# EAGLE design AlienWhoopF7-ESP32 (EAGLE 9.0.0)
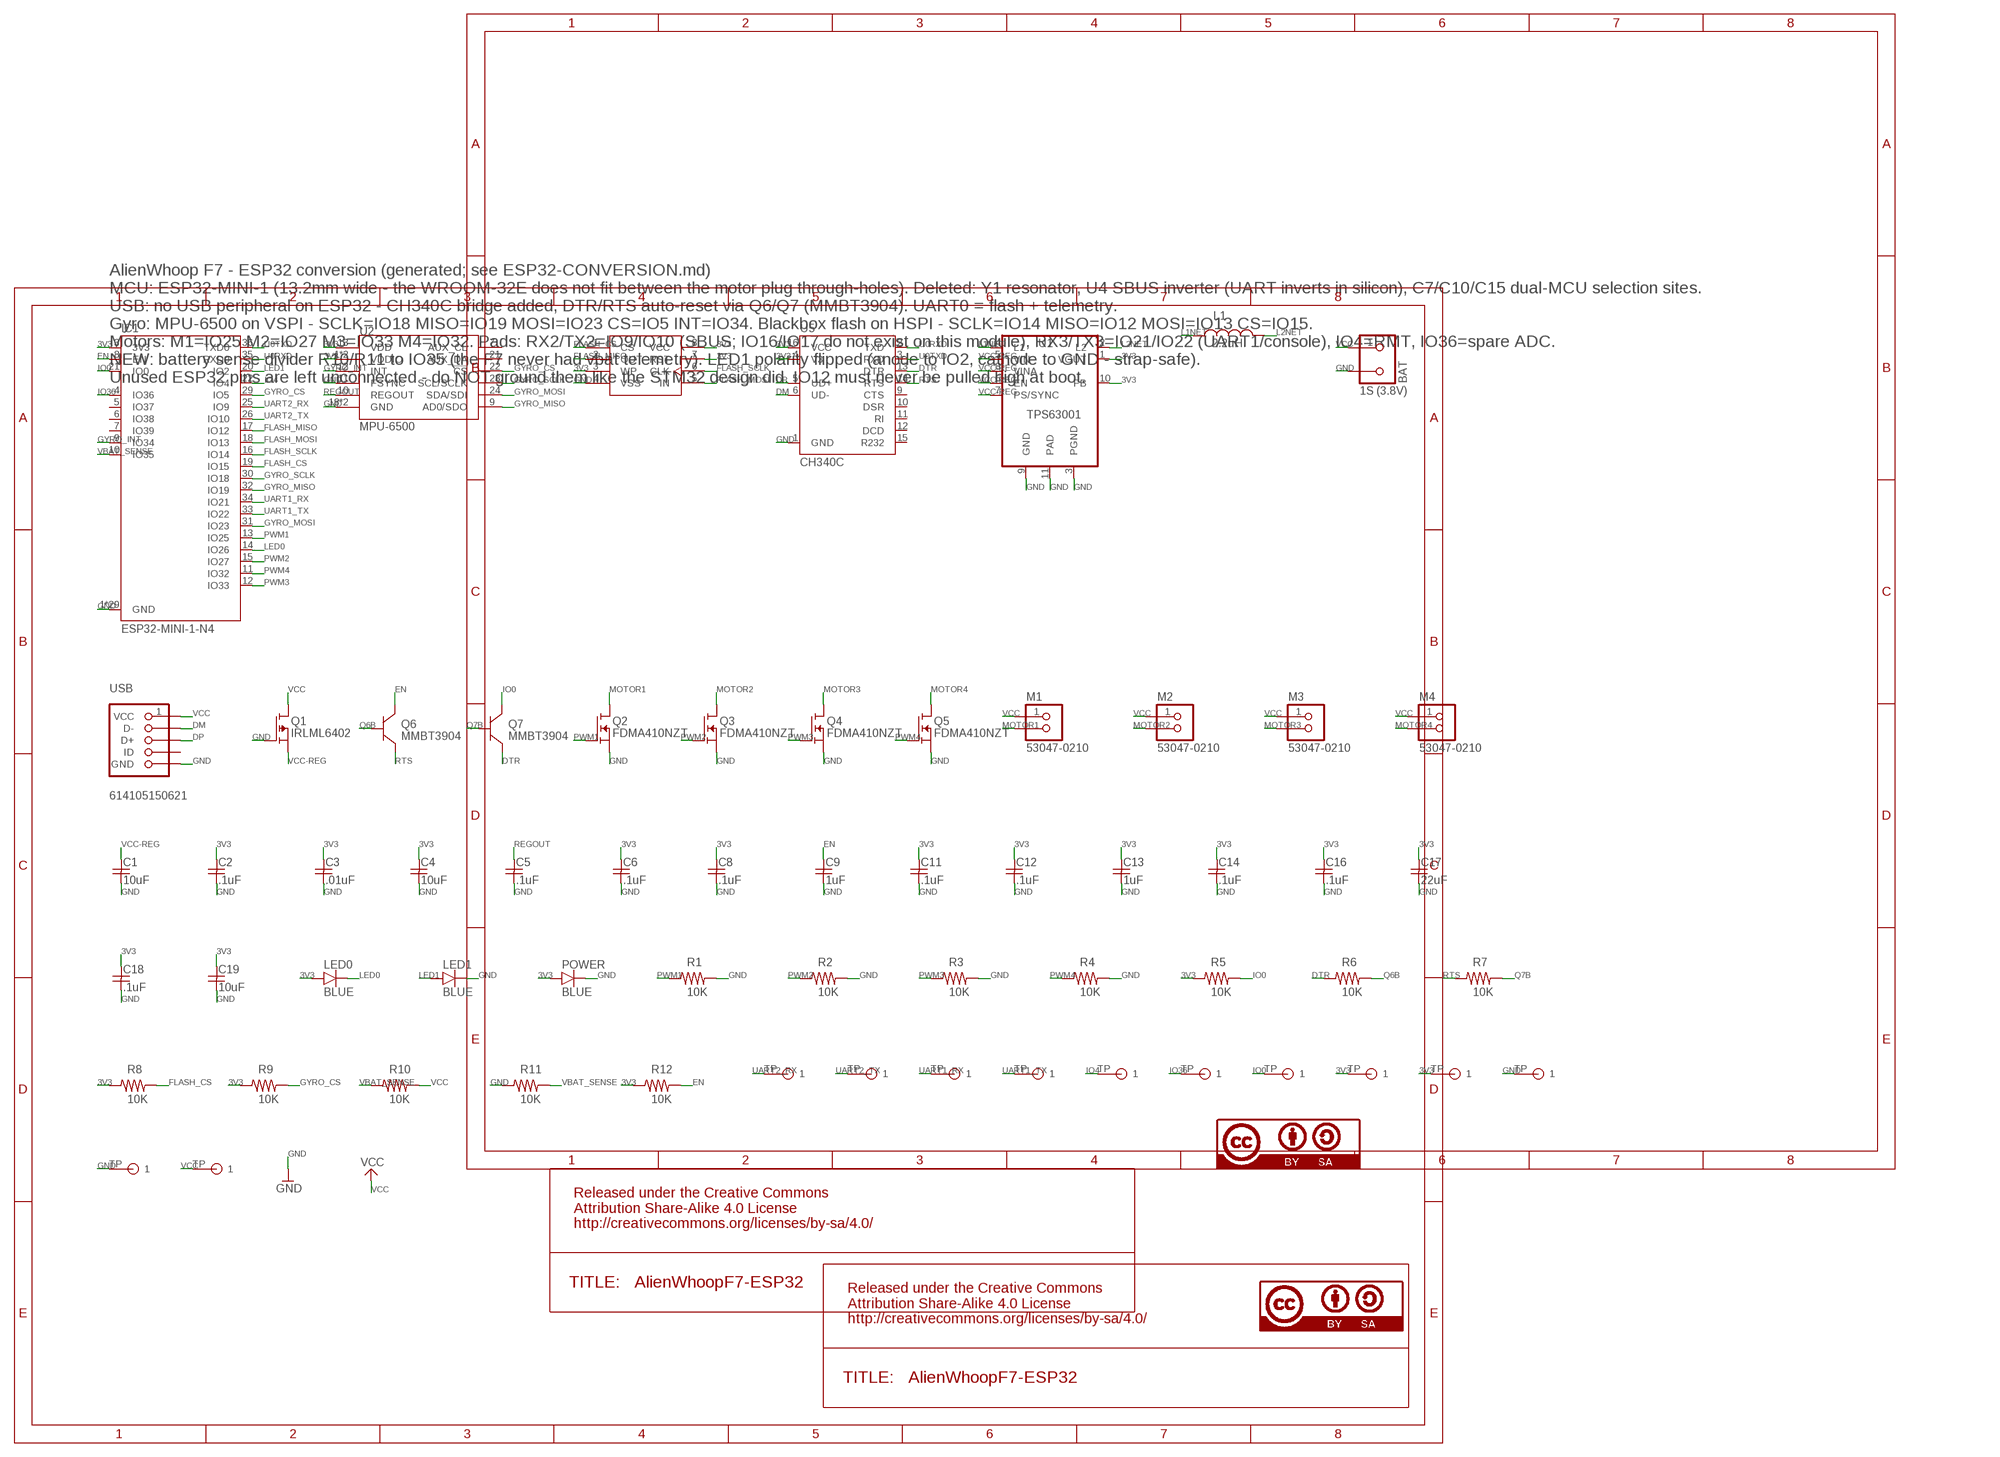
[diagram p0: schematic, sheet 1]

## Parts
3.3V  TESTPAD  [TESTPAD]
3V3  TESTPAD  [TESTPAD]
BAT  1S (3.8V)  JST-PH-BAT  [S2B-PH-K-S]
BOOT  TESTPAD  [TESTPAD]
C1  10uF  CAPACITOR10UF  [YUDEN-CAP-0805]
C2  .1uF  CAPACITOR.1UF  [MUR-CAP-0603]
C3  .01uF  CAPACITOR.01UF  [MUR-CAP-0603]
C4  10uF  CAPACITOR10UF  [YUDEN-CAP-0805]
C5  .1uF  CAPACITOR.1UF  [MUR-CAP-0603]
C6  .1uF  CAPACITOR.1UF  [MUR-CAP-0603]
C8  .1uF  CAPACITOR.1UF  [MUR-CAP-0603]
C9  1uF  CAPACITOR1UF  [MUR-CAP-0603]
C11  .1uF  CAPACITOR.1UF  [MUR-CAP-0603]
C12  .1uF  CAPACITOR.1UF  [MUR-CAP-0603]
C13  1uF  CAPACITOR1UF  [MUR-CAP-0603]
C14  .1uF  CAPACITOR.1UF  [MUR-CAP-0603]
C16  .1uF  CAPACITOR.1UF  [MUR-CAP-0603]
C17  22uF  CAPACITOR22UF  [YUDEN-CAP-0805]
C18  .1uF  CAPACITOR.1UF  [MUR-CAP-0603]
C19  10uF  CAPACITOR10UF  [YUDEN-CAP-0805]
GND  TESTPAD  [TESTPAD]
GND@1  TESTPAD  [TESTPAD]
IC1  ESP32-MINI-1-N4  ESP32-MINI-1  [ESP32-MINI-1]
IO4  TESTPAD  [TESTPAD]
IO36  TESTPAD  [TESTPAD]
L1  2.2uH  DFE201612E-2R2M-P2  [DFE201612E-2R2M-P2]
LED0  BLUE  SMD-CHIP-LED-0805  [SMD-CHIP-LED-0805]
LED1  BLUE  SMD-CHIP-LED-0805  [SMD-CHIP-LED-0805]
M1  53047-0210  PICO-1.25-MOTOR  [PICO-53047-02]
M2  53047-0210  PICO-1.25-MOTOR  [PICO-53047-02]
M3  53047-0210  PICO-1.25-MOTOR  [PICO-53047-02]
M4  53047-0210  PICO-1.25-MOTOR  [PICO-53047-02]
POWER  BLUE  SMD-CHIP-LED-0805  [SMD-CHIP-LED-0805]
Q1  IRLML6402  MOSFET-P  [SOT-23]
Q2  FDMA410NZT  FDMA410NZ  [MICROFET-2X2]
Q3  FDMA410NZT  FDMA410NZ  [MICROFET-2X2]
Q4  FDMA410NZT  FDMA410NZ  [MICROFET-2X2]
Q5  FDMA410NZT  FDMA410NZ  [MICROFET-2X2]
Q6  MMBT3904  [SOT23]
Q7  MMBT3904  [SOT23]
R1  10K  RESISTOR10K  [VISH-RES-0603]
R2  10K  RESISTOR10K  [VISH-RES-0603]
R3  10K  RESISTOR10K  [VISH-RES-0603]
R4  10K  RESISTOR10K  [VISH-RES-0603]
R5  10K  RESISTOR10K  [VISH-RES-0603]
R6  10K  RESISTOR10K  [VISH-RES-0603]
R7  10K  RESISTOR10K  [VISH-RES-0603]
R8  10K  RESISTOR10K  [VISH-RES-0603]
R9  10K  RESISTOR10K  [VISH-RES-0603]
R10  10K  RESISTOR10K  [VISH-RES-0603]
R11  10K  RESISTOR10K  [VISH-RES-0603]
R12  10K  RESISTOR10K  [VISH-RES-0603]
RX2  TESTPAD  [TESTPAD]
RX3  TESTPAD  [TESTPAD]
TX2  TESTPAD  [TESTPAD]
TX3  TESTPAD  [TESTPAD]
U1  TPS63001  TPS630XX-TPS63001  [VSON-N10]
U2  MPU-6500  MPU-9250  [QFN24_PAD]
U3  MX25L6406EM2I-12G  M25P32  [M25P32]
U5  CH340C  [SOP16]
USB  614105150621  MICROUSBUSB-BFPV  [USB-BFPV]
VCC@1  TESTPAD  [TESTPAD]

## Nets
3V3: 3.3V.TP 3V3.TP C2.1 C3.1 C4.1 C6.1 C8.1 C11.1 C12.1 C13.1 C14.1 C16.1 C17.1 C18.1 C19.1 IC1.3(3V3) LED0.A POWER.A R5.2 R8.2 R9.2 R12.2 U1.1(VOUT) U1.10(FB) U2.1(VDDIO) U2.8(VDDIO) U2.13(VDD) U3.3(WP) U3.7(RST) U3.8(VCC) U5.4(V3) U5.16(VCC)
DM: U5.6(UD-) USB.2(D-)
DP: U5.5(UD+) USB.3(D+)
DTR: Q7.2(E) R6.2 U5.13(DTR)
EN: C9.1 IC1.8(EN) Q6.3(C) R12.1
FLASH_CS: IC1.19(IO15) R8.1 U3.1(CS)
FLASH_MISO: IC1.17(IO12) U3.2(OUT)
FLASH_MOSI: IC1.18(IO13) U3.5(IN)
FLASH_SCLK: IC1.16(IO14) U3.6(CLK)
GND: BAT.2 C1.2 C2.2 C3.2 C4.2 C5.2 C6.2 C8.2 C9.2 C11.2 C12.2 C13.2 C14.2 C16.2 C17.2 C18.2 C19.2 GND.TP GND@1.TP IC1.1(GND) IC1.2(GND) IC1.27(GND) IC1.38(GND) IC1.39(GND) IC1.40(GND) IC1.41(GND) IC1.42(GND) IC1.43(GND) IC1.44(GND) IC1.45(GND) IC1.46(GND) IC1.47(GND) IC1.48(GND) IC1.49(GND) IC1.50(GND) IC1.51(GND) IC1.52(GND) IC1.53(GND) IC1.54(GND) IC1.55(GND) IC1.T1(GND) IC1.T2(GND) IC1.T3(GND) IC1.T4(GND) IC1.T5(GND) IC1.T6(GND) IC1.T7(GND) IC1.T8(GND) LED1.C POWER.C Q1.1(G) Q2.S Q2.S1(S) Q3.S Q3.S1(S) Q4.S Q4.S1(S) Q5.S Q5.S1(S) R1.1 R2.1 R3.1 R4.1 R11.2 U1.3(PGND) U1.9(GND) U1.11(PAD) U2.11(FSYNC) U2.18(GND) U2.20(GND) U3.4(VSS) U5.1(GND) USB.5(GND) USB.P$6(GND) USB.P$7(GND)
GYRO_CS: IC1.29(IO5) R9.1 U2.22(!CS)
GYRO_INT: IC1.9(IO34) U2.12(INT)
GYRO_MISO: IC1.32(IO19) U2.9(AD0/SDO)
GYRO_MOSI: IC1.31(IO23) U2.24(SDA/SDI)
GYRO_SCLK: IC1.30(IO18) U2.23(SCL/SCLK)
IO0: BOOT.TP IC1.21(IO0) Q7.3(C) R5.1
IO4: IC1.22(IO4) IO4.TP
IO36: IC1.4(IO36) IO36.TP
L1NET: L1.P$1 U1.4(L1)
L2NET: L1.P$2 U1.2(L2)
LED0: IC1.14(IO26) LED0.C
LED1: IC1.20(IO2) LED1.A
MOTOR1: M1.2 Q2.D Q2.D1(D) Q2.D2(D) Q2.D3(D) Q2.D4(D)
MOTOR2: M2.2 Q3.D Q3.D1(D) Q3.D2(D) Q3.D3(D) Q3.D4(D)
MOTOR3: M3.2 Q4.D Q4.D1(D) Q4.D2(D) Q4.D3(D) Q4.D4(D)
MOTOR4: M4.2 Q5.D Q5.D1(D) Q5.D2(D) Q5.D3(D) Q5.D4(D)
PWM1: IC1.13(IO25) Q2.G R1.2
PWM2: IC1.15(IO27) Q3.G R2.2
PWM3: IC1.12(IO33) Q4.G R3.2
PWM4: IC1.11(IO32) Q5.G R4.2
Q6B: Q6.1(B) R6.1
Q7B: Q7.1(B) R7.1
REGOUT: C5.1 U2.10(REGOUT)
RTS: Q6.2(E) R7.2 U5.14(RTS)
U0RXD: IC1.35(RXD0) U5.2(TXD)
U0TXD: IC1.36(TXD0) U5.3(RXD)
UART1_RX: IC1.34(IO21) RX3.TP
UART1_TX: IC1.33(IO22) TX3.TP
UART2_RX: IC1.25(IO9) RX2.TP
UART2_TX: IC1.26(IO10) TX2.TP
VBAT_SENSE: IC1.10(IO35) R10.2 R11.1
VCC: BAT.1 M1.1 M2.1 M3.1 M4.1 Q1.3(D) R10.1 USB.1(VCC) VCC@1.TP
VCC-REG: C1.1 Q1.2(S) U1.5(VIN) U1.6(EN) U1.7(PS/SYNC) U1.8(VINA)
Unconnected: IC1.5(IO37) IC1.6(IO38) IC1.7(IO39) U2.7(AUX_CL) U2.21(AUX_DA) U5.9(CTS) U5.10(DSR) U5.11(RI) U5.12(DCD) U5.15(R232) USB.4(ID)

## Notes on the sheet
- AlienWhoop F7 - ESP32 conversion (generated; see ESP32-CONVERSION.md)
- MCU: ESP32-MINI-1 (13.2mm wide - the WROOM-32E does not fit between the motor plug through-holes). Deleted: Y1 resonator, U4 SBUS inverter (UART inverts in silicon), C7/C10/C15 dual-MCU selection sites.
- USB: no USB peripheral on ESP32 - CH340C bridge added, DTR/RTS auto-reset via Q6/Q7 (MMBT3904). UART0 = flash + telemetry.
- Gyro: MPU-6500 on VSPI - SCLK=IO18 MISO=IO19 MOSI=IO23 CS=IO5 INT=IO34. Blackbox flash on HSPI - SCLK=IO14 MISO=IO12 MOSI=IO13 CS=IO15.
- Motors: M1=IO25 M2=IO27 M3=IO33 M4=IO32. Pads: RX2/TX2=IO9/IO10 (SBUS; IO16/IO17 do not exist on this module), RX3/TX3=IO21/IO22 (UART1/console), IO4=RMT, IO36=spare ADC.
- NEW: battery sense divider R10/R11 to IO35 (the F7 never had vbat telemetry). LED1 polarity flipped (anode to IO2, cathode to GND - strap-safe).
- Unused ESP32 pins are left unconnected - do NOT ground them like the STM32 design did. IO12 must never be pulled high at boot.

## Library data of the parts
3.3V 3V3 BOOT GND GND@1 IO4 IO36 RX2 RX3 TX2 TX3 VCC@1 = AlienWhoop:TESTPAD: Test pad also can be used for tiny solder pad for signal; BOM: EXCLUDE; DNP: T
BAT = alienflight:JST-PH-BAT: Battery Connector JST- S2B-PH-K-S View Datasheet <http://www.jst-mfg.com/product/pdf/eng/ePH.pdf> Author: Lance Source: http://alienflight.com License: CC BY SA <creativecommons.org/licenses/by-sa/4.0/>; DNP: T; MF: JST; MPN: S2B-PH-K-S
C1 C4 C19 = alienflight:CAPACITOR: CAPACITORS Murata Datasheet <http://www.murata.com/~/media/webrenewal/support/library/catalog/products/capacitor/mlcc/c02e.ashx?la=en-us> Taiyo Yuden Datasheet <http://www.mouser.com/ds/2/396/mlcc11_hq_e-541564.pdf> Author: Lance Source: http://alienflight.com License: CC BY SA <creativecommons.org/licenses/by-sa/4.0/>; MF: Taiyo Yuden; MPN: JMK212AB7106KG-T
C2 C5 C6 C8 C11 C12 C14 C16 C18 = alienflight:CAPACITOR: CAPACITORS Murata Datasheet <http://www.murata.com/~/media/webrenewal/support/library/catalog/products/capacitor/mlcc/c02e.ashx?la=en-us> Taiyo Yuden Datasheet <http://www.mouser.com/ds/2/396/mlcc11_hq_e-541564.pdf> Author: Lance Source: http://alienflight.com License: CC BY SA <creativecommons.org/licenses/by-sa/4.0/>; MF: Murata; MPN: GRM188R71C104KA01D
C3 = alienflight:CAPACITOR: CAPACITORS Murata Datasheet <http://www.murata.com/~/media/webrenewal/support/library/catalog/products/capacitor/mlcc/c02e.ashx?la=en-us> Taiyo Yuden Datasheet <http://www.mouser.com/ds/2/396/mlcc11_hq_e-541564.pdf> Author: Lance Source: http://alienflight.com License: CC BY SA <creativecommons.org/licenses/by-sa/4.0/>; MF: Murata; MPN: GRM188R71C103KA01D
C9 C13 = alienflight:CAPACITOR: CAPACITORS Murata Datasheet <http://www.murata.com/~/media/webrenewal/support/library/catalog/products/capacitor/mlcc/c02e.ashx?la=en-us> Taiyo Yuden Datasheet <http://www.mouser.com/ds/2/396/mlcc11_hq_e-541564.pdf> Author: Lance Source: http://alienflight.com License: CC BY SA <creativecommons.org/licenses/by-sa/4.0/>; MF: Murata; MPN: GRM188R71C105KA12D
C17 = alienflight:CAPACITOR: CAPACITORS Murata Datasheet <http://www.murata.com/~/media/webrenewal/support/library/catalog/products/capacitor/mlcc/c02e.ashx?la=en-us> Taiyo Yuden Datasheet <http://www.mouser.com/ds/2/396/mlcc11_hq_e-541564.pdf> Author: Lance Source: http://alienflight.com License: CC BY SA <creativecommons.org/licenses/by-sa/4.0/>; MF: Taiyo Yuden; MPN: JMK212BJ226MG-T
IC1 = esp32:ESP32-MINI-1: Espressif ESP32-MINI-1 (PCB antenna) / ESP32-MINI-1U (u.FL) - same land pattern, population choice. ESP32-U4WDH: dual-core LX6 @ 240 MHz, 4 MB in-package flash. GPIO6/7/8/11/16/17 are consumed by that flash - IO16/IO17 DO NOT EXIST on this module; IO9/IO10 are exposed instead. No USB peripheral - UART0 is the programming/telemetry port.
L1 = AlienWhoop:DFE201612E-2R2M-P2: Murata Fixed Inductors 0806 2.2uH 20% 2.4A RDC=0.116ohms
LED0 LED1 POWER = alienflight:SMD-CHIP-LED-0805: SMD CHIP LED APHCM2012QBC/D-F01 View Datasheet <https://www.kingbrightusa.com/images/catalog/spec/APHCM2012QBC-D-F01.pdf> Author: Lance Source: http://alienflight.com License: CC BY SA <creativecommons.org/licenses/by-sa/4.0/>; MF: Kingbright; MPN: APHCM2012QBC/D-F01
M1-M4 = alienflight:PICO-1.25-MOTOR: Motor Connector PicoBlade 1.25 53047-02 View Datasheet <http://www.molex.com/webdocs/datasheets/pdf/en-us/0530470210_PCB_HEADERS.pdf> Author: Lance Source: http://alienflight.com License: CC BY SA <creativecommons.org/licenses/by-sa/4.0/>; MF: MOLEX; MPN: 53047-0210
Q1 = alienflight:MOSFET-P: P-Channel MOSFET IRLML6402 Datasheet <http://www.irf.com/product-info/datasheets/data/irlml6402pbf.pdf> Author: Lance Source: Alienflight.com License: CC BY SA <creativecommons.org/licenses/by-sa/4.0/>; MF: IR; MPN: IRLML6402
Q2-Q5 = alienflight:FDMA410NZ: N-Channel MOSFET FDMA410NZ View Datasheet <https://www.fairchildsemi.com/datasheets/FD/FDMA410NZ.pdf> Author: Lance Source: http://alienflight.com License: CC BY SA <creativecommons.org/licenses/by-sa/4.0/>; MF: Fairchild; MPN: FDMA410NZ; VALUE: FDMA410NZ
Q6 Q7 = esp32:MMBT3904: NPN small-signal transistor, SOT-23 (1=B 2=E 3=C). Auto-reset pair for esptool DTR/RTS.
R1-R12 = alienflight:RESISTOR: RESISTORS Vishay DataSheet <http://www.vishay.com/docs/20043/crcwhpe3.pdf> Author: Lance Source: http://alienflight.com License: CC BY SA <creativecommons.org/licenses/by-sa/4.0/>; MF: Vishay; MPN: CRCW060310K0FKEAHP
U1 = alienflight:TPS630XX: Buck/Boost Converter TPS63001/2 Datasheet <http://www.ti.com/lit/ds/symlink/tps63001.pdf> Author: Lance Source: http://alienflight.com License: CC BY SA <creativecommons.org/licenses/by-sa/4.0/>; MF: TI; MPN: TPS63001DRCR
U2 = Sparkfun:MPU-9250: NC pin 19. 2-6 & 14-17 not internally connected. May be used for PCB trace routing.; PROD_ID: IC-13192
U3 = AlienWhoop:M25P32: Dataflash
U5 = esp32:CH340C: WCH CH340C USB-UART bridge, SOP-16, internal oscillator. For 3.3 V operation tie V3 to VCC=3V3. DTR/RTS drive the ESP32 auto-reset pair.
USB = AlienWhoop:MICROUSB: Molex USB Connectors uUSB B Rec Vertical TH 2.30

## Board
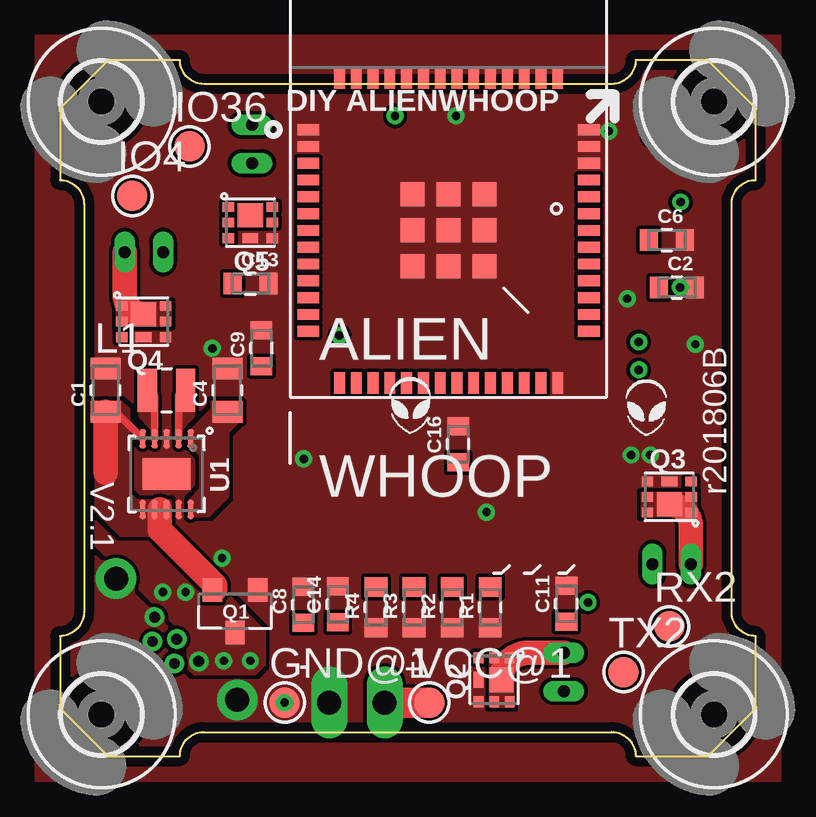
[diagram p1: board, top side]
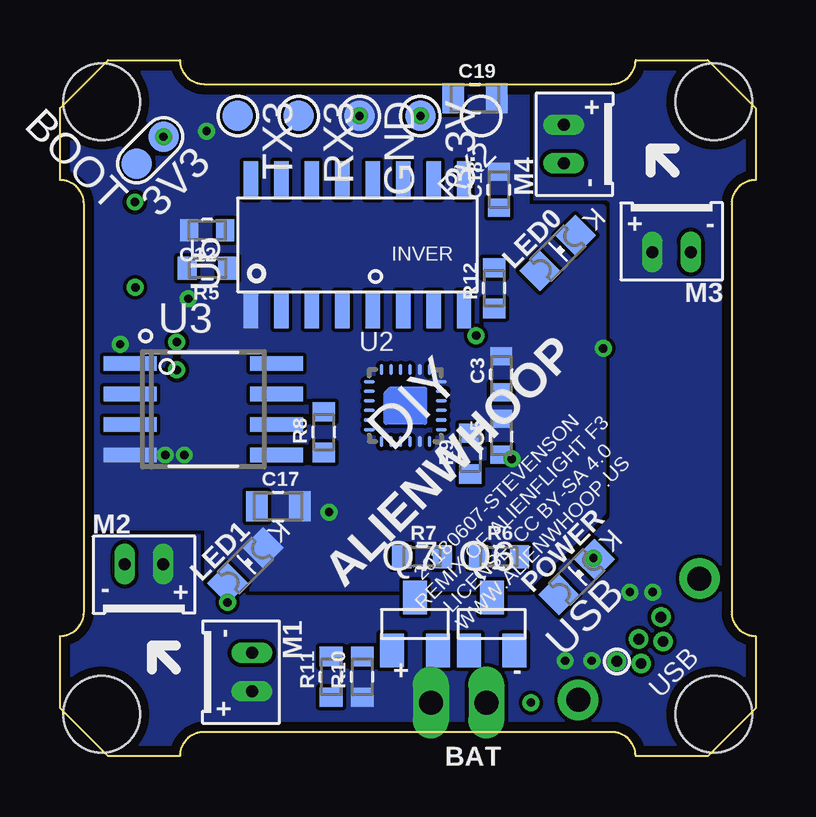
[diagram p2: board, bottom side, seen from below]

Size 29 x 29 mm. Coordinates in mm from the lower left corner, seen from the top.
Outline: 0,27 0,24 arc-90 1,23 1,6 arc-90 0,5 0,2 2,0 5,0 arc-90 6,1 23,1 arc-90 24,0 27,0 29,2 29,5 arc-90 28,6 28,23 arc-90 29,24 29,27 27,29 24,29 arc-90 23,28 6,28 arc-90 5,29 2,29 0,27
Copper layers (1*16): Top 0.0356mm / dielectric 1.5011mm / Bottom 0.0356mm
Design rules "oshpark-2layer *": minimum track width 6mil, minimum drill 13mil, track to track 6mil, track to pad 6mil, pad to pad 6mil, via to via 6mil, smd to smd 6mil, copper to edge 15mil, drill to drill 6mil, minimum pad ring 7mil, minimum via ring 7mil, stop-mask expansion 2.5mil, vias tented up to drill 24mil, thermal gap 10mil

### Footprints (pad centres in the part's own frame; a part is rotated, then mirrored left to right if it is on the bottom)
TESTPAD = smd 1.27 x 1.27: TP 0,0
S2B-PH-K-S = drill 1 long: 1 1.159,0; 2 -1.159,0
YUDEN-CAP-0805 = smd 0.9 x 1.25: 1 -0.9,0; 2 0.9,0
MUR-CAP-0603 = smd 0.75 x 0.9: 1 -0.75,0; 2 0.75,0
ESP32-MINI-1 = smd 0.9 x 0.45: 1 -5.85,4.2; 2 -5.85,3.5; 3 -5.85,2.8; 4 -5.85,2.1; 5 -5.85,1.4; 6 -5.85,0.7; 7 -5.85,0; 8 -5.85,-0.7; 9 -5.85,-1.4; 10 -5.85,-2.1; 11 -5.85,-2.8; 12 -5.85,-3.5; 13 -5.85,-4.2; 28 5.85,-4.2; 29 5.85,-3.5; 30 5.85,-2.8; 31 5.85,-2.1; 32 5.85,-1.4; 33 5.85,-0.7; 34 5.85,0; 35 5.85,0.7; 36 5.85,1.4; 37 5.85,2.1; 38 5.85,2.8; 39 5.85,3.5; 40 5.85,4.2 | smd 0.45 x 0.9: 14 -4.55,-6.35; 15 -3.85,-6.35; 16 -3.15,-6.35; 17 -2.45,-6.35; 18 -1.75,-6.35; 19 -1.05,-6.35; 20 -0.35,-6.35; 21 0.35,-6.35; 22 1.05,-6.35; 23 1.75,-6.35; 24 2.45,-6.35; 25 3.15,-6.35; 26 3.85,-6.35; 27 4.55,-6.35; 41 4.55,6.35; 42 3.85,6.35; 43 3.15,6.35; 44 2.45,6.35; 45 1.75,6.35; 46 1.05,6.35; 47 0.35,6.35; 48 -0.35,6.35; 49 -1.05,6.35; 50 -1.75,6.35; 51 -2.45,6.35; 52 -3.15,6.35; 53 -3.85,6.35; 54 -4.55,6.35 | smd 1 x 1: 55 0,0; T1 -1.5,1.5; T2 0,1.5; T3 1.5,1.5; T4 -1.5,0; T5 1.5,0; T6 -1.5,-1.5; T7 0,-1.5; T8 1.5,-1.5
DFE201612E-2R2M-P2 = smd 0.8 x 1.8: P$1 -0.8,0; P$2 0.8,0
SMD-CHIP-LED-0805 = smd 1.2 x 1.2: A -1.05,0; C 1.05,0
PICO-53047-02 = drill 0.5 pad 0.813 long: 1 0.8,0; 2 -0.8,0
SOT-23 = smd 0.802 x 0.972: 1 -0.95,-0.885; 2 0.95,-0.885; 3 0,0.885
MICROFET-2X2 = smd 1 x 1.05: D -0.3,0 | smd 0.4 x 0.47: D1 -0.65,0.915; D2 0,0.915; D3 -0.65,-0.915; D4 0,-0.915; G 0.65,-0.915; S1 0.65,0.915 | smd 0.4 x 0.66: S 0.65,0
SOT23 = smd 1 x 1.4: 1 -0.95,-1.1; 2 0.95,-1.1; 3 0,1.1
VISH-RES-0603 = smd 0.8 x 0.95: 1 -0.85,0; 2 0.85,0
VSON-N10 = smd 0.8 x 0.26: 1 -1.475,1; 2 -1.475,0.5; 3 -1.475,0; 4 -1.475,-0.5; 5 -1.475,-1; 6 1.475,-1; 7 1.475,-0.5; 8 1.475,0; 9 1.475,0.5; 10 1.475,1 | smd 1.3 x 2: 11 0,0
QFN24_PAD = smd 0.457 x 0.152: 1 -1.5,1; 2 -1.5,0.6; 3 -1.5,0.2; 4 -1.5,-0.2; 5 -1.5,-0.6; 6 -1.5,-1; 13 1.5,-1; 14 1.5,-0.6; 15 1.5,-0.2; 16 1.5,0.2; 17 1.5,0.6; 18 1.5,1 | smd 0.152 x 0.457: 7 -1,-1.5; 8 -0.6,-1.5; 9 -0.2,-1.5; 10 0.2,-1.5; 11 0.6,-1.5; 12 1,-1.5; 19 1,1.5; 20 0.6,1.5; 21 0.2,1.5; 22 -0.2,1.5; 23 -0.6,1.5; 24 -1,1.5
M25P32 = smd 0.6 x 2.2: 1 -1.905,-3.048; 2 -0.635,-3.048; 3 0.635,-3.048; 4 1.905,-3.048; 5 1.905,3.048; 6 0.635,3.048; 7 -0.635,3.048; 8 -1.905,3.048
SOP16 = smd 1.55 x 0.6: 1 -2.7,4.445; 2 -2.7,3.175; 3 -2.7,1.905; 4 -2.7,0.635; 5 -2.7,-0.635; 6 -2.7,-1.905; 7 -2.7,-3.175; 8 -2.7,-4.445; 9 2.7,-4.445; 10 2.7,-3.175; 11 2.7,-1.905; 12 2.7,-0.635; 13 2.7,0.635; 14 2.7,1.905; 15 2.7,3.175; 16 2.7,4.445
3,2 = hole 3.2: 0,0
USB-BFPV = drill 0.45 pad 0.813: 1 -1.3,0; 2 -0.65,-0.78; 3 0,0; 4 0.65,-0.78; 5 1.3,0 | drill 1 pad 1.676: P$6 -3.575,0; P$7 3.575,0

### Placement (x,y rotation side)
3.3V  [TESTPAD]  13.97,26.67 270 bottom
3V3  [TESTPAD]  24.68,25.8 225 bottom
BAT  [S2B-PH-K-S]  12.38,2.22 180 bottom
BOOT  [TESTPAD]  25.8,24.68 135 bottom
C1  [YUDEN-CAP-0805]  1.91,15.24 90 top
C2  [MUR-CAP-0603]  25.72,19.53 0 top
C3  [MUR-CAP-0603]  10.6,15.9 90 bottom
C4  [YUDEN-CAP-0805]  6.99,15.24 90 top
C5  [MUR-CAP-0603]  10.6,13.3 90 bottom
C6  [MUR-CAP-0603]  25.3,21.5 0 top
C8  [MUR-CAP-0603]  10.15,6.3 90 top
C9  [MUR-CAP-0603]  8.4,17 90 top
C11  [MUR-CAP-0603]  21.11,6.35 90 top
C12  [MUR-CAP-0603]  22.86,21.91 180 bottom
C13  [MUR-CAP-0603]  7.94,19.68 0 top
C14  [MUR-CAP-0603]  11.59,6.32 90 top
C16  [MUR-CAP-0603]  16.6,13 90 top
C17  [YUDEN-CAP-0805]  19.9,10.4 0 bottom
C18  [MUR-CAP-0603]  10.7,23.6 90 bottom
C19  [YUDEN-CAP-0805]  11.7,27.4 0 bottom
GND  [TESTPAD]  16.51,26.67 270 bottom
GND@1  [TESTPAD]  9.37,2.22 0 top
IC1  [ESP32-MINI-1]  16.2,21.9 0 top
IO4  [TESTPAD]  3.02,23.34 0 top
IO36  [TESTPAD]  5.4,25.4 0 top
L1  [DFE201612E-2R2M-P2]  4.45,15.24 0 top
LED0  [SMD-CHIP-LED-0805]  8.26,20.95 45 bottom
LED1  [SMD-CHIP-LED-0805]  21.27,7.94 45 bottom
M1  [PICO-53047-02]  21,3.5 270 bottom
M2  [PICO-53047-02]  25.5,8 0 bottom
M3  [PICO-53047-02]  3.5,21 180 bottom
M4  [PICO-53047-02]  8,25.5 90 bottom
POWER  [SMD-CHIP-LED-0805]  7.46,7.46 45 bottom
Q1  [SOT-23]  7.3,6.03 180 top
Q2  [MICROFET-2X2]  18.1,3.17 180 top
Q3  [MICROFET-2X2]  25.4,10.79 90 top
Q4  [MICROFET-2X2]  3.49,18.1 270 top
Q5  [MICROFET-2X2]  7.94,22.23 270 top
Q6  [SOT23]  11,5.5 0 bottom
Q7  [SOT23]  14.2,5.5 0 bottom
R1  [VISH-RES-0603]  17.94,6.19 90 top
R2  [VISH-RES-0603]  16.35,6.19 90 top
R3  [VISH-RES-0603]  14.76,6.19 90 top
R4  [VISH-RES-0603]  13.18,6.19 90 top
R5  [VISH-RES-0603]  22.85,20.32 180 bottom
R6  [VISH-RES-0603]  10.7,8.3 0 bottom
R7  [VISH-RES-0603]  13.9,8.3 0 bottom
R8  [VISH-RES-0603]  18,13.5 90 bottom
R9  [VISH-RES-0603]  11.9,12.6 90 bottom
R10  [VISH-RES-0603]  16.4,3.3 90 bottom
R11  [VISH-RES-0603]  17.7,3.3 90 bottom
R12  [VISH-RES-0603]  10.9,19.5 90 bottom
RX2  [TESTPAD]  25.4,5.4 0 top
RX3  [TESTPAD]  19.05,26.67 270 bottom
TX2  [TESTPAD]  23.5,3.49 0 top
TX3  [TESTPAD]  21.59,26.67 270 bottom
U1  [VSON-N10]  4.45,11.75 270 top
U2  [QFN24_PAD]  14.6,14.6 0 bottom
U3  [M25P32]  23.02,14.45 270 bottom
U5  [SOP16]  16.6,21.3 90 bottom
U$1  [3,2]  1.74,27.27 0 top
U$2  [3,2]  27.27,27.27 0 top
U$3  [3,2]  27.27,1.74 0 top
U$4  [3,2]  1.74,1.74 0 top
USB  [USB-BFPV]  4.87,4.87 45 bottom
VCC@1  [TESTPAD]  15.4,2.22 0 top

### Tracks (layer width: path | path; a pad name or v marks a point on that pad's centre or on a via)
3V3  (via drill 0.35)
  other vias: 13.97,26.67 24.68,25.8 25.88,23.08 11.65,17.51 22.01,6.4 24.13,16.09 25.86,19.53 24.13,17.25
  pour Top (no thermals): 5.4,13.49 5.4,13.02 5.87,12.54 5.87,11.11 5.4,10.64 5.4,10 6.19,10 6.99,10.79 6.99,13.49 7.46,13.97 7.46,14.76 6.35,14.76 6.35,14.45
GND  (via drill 0.35)
  other vias: 9.37,2.22 16.51,26.67 24.61,12.54 10.16,12.38 22.89,26.04 26.49,17.16 6.76,8.25 23.81,12.54 6.35,16.99 17.78,10.16 23.65,19.05
  pour Top (rank 3, no thermals): -1,30 -1,-1 30,-1 30,30
  pour Top (no thermals): 3.17,17.62 3.17,16.83 1.11,16.83 1.11,15.24 3.02,15.24 3.02,16.35 4.29,16.35 6.03,16.35 6.03,15.4 7.94,15.4 7.94,17.94 5.08,17.94 4.76,17.62
  pour Bottom (no thermals): 6.35,10.16 6.35,22.86 9.53,22.86 9.53,29.21 29.21,29.21 29.21,9.53 22.86,9.53 22.86,6.99 9.53,6.99
L1NET
  Top 0.305: U1.4 3.94,14.94 arc90 L1.P$1
  pour Top (no thermals): 3.33,16.03 3.33,14.45 3.33,14.13 3.81,13.65 3.97,13.65 3.97,16.03
L2NET
  Top 0.305: U1.2 4.95,14.94 arc-90 L1.P$2
  pour Top (no thermals): 4.92,16.03 5.56,16.03 5.56,14.45 5.56,14.13 4.92,13.49
MOTOR1
  Top 1.016: Q2.D arc-90 19.52,4.3 M1.2
  pour Top (no thermals): 17.94,4.29 18.89,4.29 18.89,2.06 17.94,2.06
MOTOR2
  Top 1.016: M2.2 26.3,9.6 arc90 Q3.D
  pour Top (no thermals): 24.29,10 26.51,10 26.51,10.95 24.29,10.95
MOTOR3
  Top 1.016: Q4.D arc-90 2.7,19.19 M3.2
  pour Top (no thermals): 2.38,17.94 4.6,17.94 4.6,18.89 2.38,18.89
VCC  (via drill 0.35)
  Top 1.27: BAT.1 VCC@1.TP
  other vias: 4.29,6.83 5.24,6.83 6.83,3.97 7.94,3.97
  pour Bottom (isolate 0.076, rank 2, no thermals): -2,31 -2,-2 31,-2 31,31
  pour Top (rank 2, no thermals): 1.27,10.16 1.27,9.02 5.33,4.95 5.33,3.68 5.59,3.43 8.13,3.43 8.38,3.68 8.51,3.81 8.51,5.21 4.7,9.02 2.54,9.02 1.4,10.16
VCC-REG
  Top 0.305: U1.5 2.33,14.34 C1.1 | Q1.2 6.36,7 6.47,7.11
  Top 1.016: C1.1 1.91,11.81 | 6.47,6.96 6.47,7.11 4.16,9.42 4.16,10.27
  pour Top (no thermals): 1.27,14.76 2.54,14.76 2.86,14.45 2.86,10.95 3.17,10.64 3.33,10.64 4.6,10.64 4.6,9.68 4.13,9.21 3.65,9.21 2.54,9.21 1.27,10.48

### Text on the board
tPlace: DIY ALIENWHOOP | ALIEN | r201806B | V2.1 | WHOOP
bPlace: RX2 | K | INVER | ALIENWHOOP | DIY | K | 20180607-STEVENSON / REMIX OF ALIENFLIGHT F3 / LICENSE: CC BY-SA 4.0 / WWW.ALIENWHOOP.US | K | USB
Guide: Released under the Creative Commons Attribution-ShareAlike 4.0 International License / https://creativecommons.org/licenses/by-sa/4.0/ | THIS BOARD DESIGN IS PROVIDED AS IS WITHOUT ANY EXPRESS OR IMPLIED WARRANTIES. / INCLUDING, BUT NOT LIMITED TO, THE IMPLIED WARRANTIES OF MERCHANTABILITY AND / FITNESS FOR A PARTICULAR PURPOSE. | Remixed from the AlienFlight F3 brushed quad by Charles Stevenson / Lance's original work available at http://alienflight.com/f3-brushed-quad/ | WWW.ALIENWHOOP.US